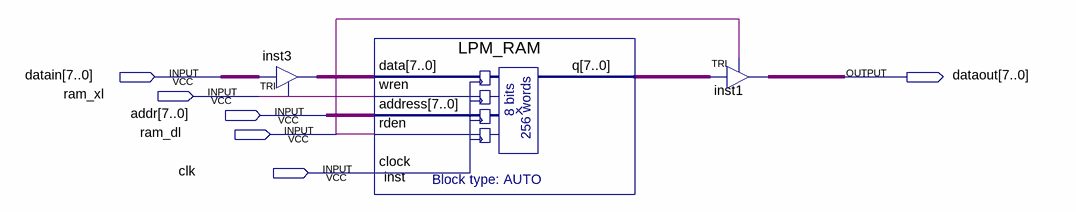
[diagram p0: schematic sheet]
// Quartus schematic RAM.bdf as structural Verilog: 3 symbols, 6 pins
module RAM (
  input  [7:0] datain,
  input  ram_xl,
  input  [7:0] addr,
  input  ram_dl,
  input  clk,
  output [7:0] dataout
);

  wire [7:0] inst3_out, inst_q;

  TRI inst3[7:0] (.IN(datain), .OE(ram_xl), .OUT(inst3_out));
  LPM_RAM inst (.data(inst3_out), .wren(ram_xl), .address(addr), .rden(ram_dl), .clock(clk), .q(inst_q));
  TRI inst1[7:0] (.IN(inst_q), .OE(ram_dl), .OUT(dataout));
endmodule
